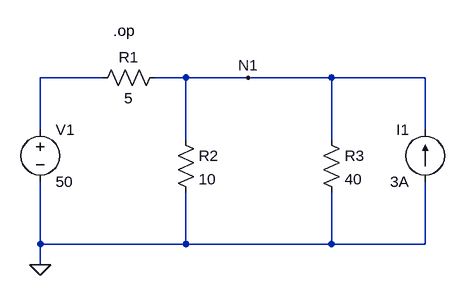
[diagram p0: schematic circuit1.asc]
circuit1.asc, the LTspice schematic file:
Version 4
SHEET 1 1372 680
WIRE 272 48 176 48
WIRE 400 48 352 48
WIRE 496 48 400 48
WIRE 624 48 496 48
WIRE 768 48 624 48
WIRE 176 128 176 48
WIRE 768 128 768 48
WIRE 400 144 400 48
WIRE 624 144 624 48
WIRE 176 304 176 208
WIRE 400 304 400 224
WIRE 400 304 176 304
WIRE 624 304 624 224
WIRE 624 304 400 304
WIRE 768 304 768 208
WIRE 768 304 624 304
WIRE 176 336 176 304
FLAG 176 336 0
FLAG 496 48 N1
SYMBOL voltage 176 112 R0
SYMATTR InstName V1
SYMATTR Value 50
SYMBOL res 256 64 R270
WINDOW 0 32 56 VTop 2
WINDOW 3 0 56 VBottom 2
SYMATTR InstName R1
SYMATTR Value 5
SYMBOL res 384 128 R0
SYMATTR InstName R2
SYMATTR Value 10
SYMBOL res 608 128 R0
SYMATTR InstName R3
SYMATTR Value 40
SYMBOL current 768 208 R180
WINDOW 0 24 80 Left 2
WINDOW 3 24 0 Left 2
SYMATTR InstName I1
SYMATTR Value 3A
TEXT 288 -24 Left 2 !.op

The netlist it stands for:
* circuit1.asc
V1 N001 0 50
R1 N001 N1 5
R2 N1 0 10
R3 N1 0 40
I1 0 N1 3A
.op
.backanno
.end